# EAGLE design hydrabot (EAGLE 9.6.2)
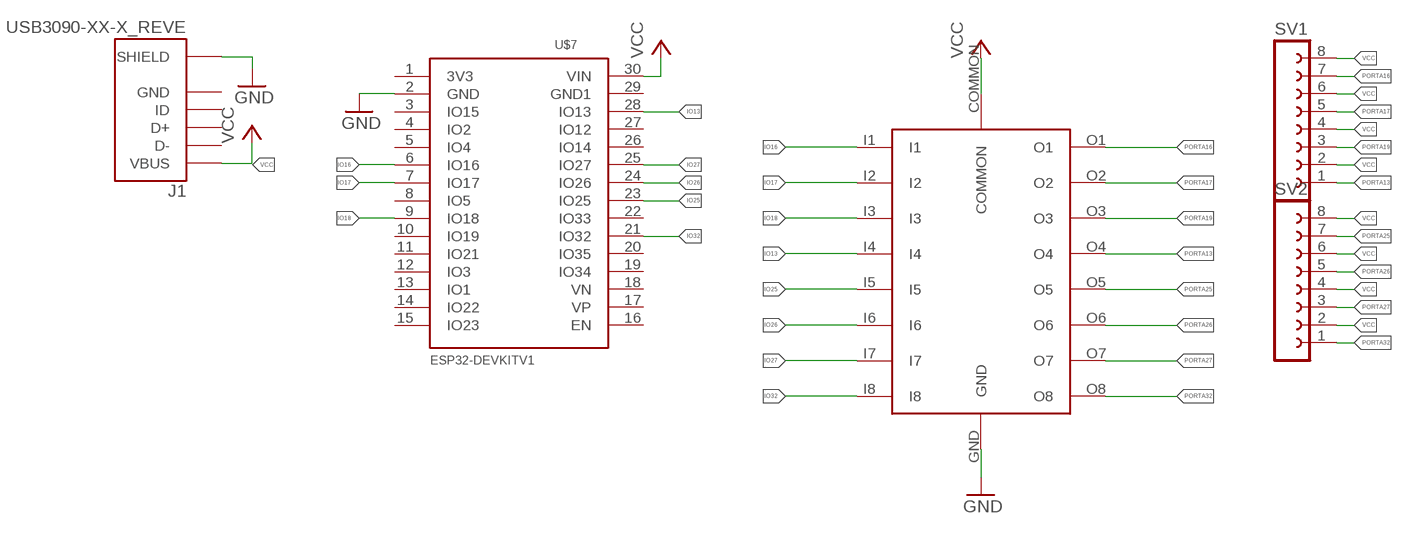
[diagram p0: schematic, sheet 1]

## Parts
J1  USB3090-XX-X_REVE  [GCT_USB3090-XX-X_REVE]
SV1  FE08-1  [FE08]
SV2  FE08-1  [FE08]
U$7  ESP32DEVKITV1  [ESP32-DEVKITV1]
ULN2803  ULN2803AFW  [ULN2803AFW]

## Nets
GND: J1.6(SHIELD) J1.7(SHIELD) J1.8(SHIELD) J1.9(SHIELD) U$7.2(GND) ULN2803.GND
IO13: U$7.28(IO13) ULN2803.I4
IO16: U$7.6(IO16) ULN2803.I1
IO17: U$7.7(IO17) ULN2803.I2
IO18: U$7.9(IO18) ULN2803.I3
IO25: U$7.23(IO25) ULN2803.I5
IO26: U$7.24(IO26) ULN2803.I6
IO27: U$7.25(IO27) ULN2803.I7
IO32: U$7.21(IO32) ULN2803.I8
PORTA13: SV1.1 ULN2803.O4
PORTA16: SV1.7 ULN2803.O1
PORTA17: SV1.5 ULN2803.O2
PORTA19: SV1.3 ULN2803.O3
PORTA25: SV2.7 ULN2803.O5
PORTA26: SV2.5 ULN2803.O6
PORTA27: SV2.3 ULN2803.O7
PORTA32: SV2.1 ULN2803.O8
VCC: J1.1(VBUS) SV1.2 SV1.4 SV1.6 SV1.8 SV2.2 SV2.4 SV2.6 SV2.8 U$7.30(VIN) ULN2803.COMMON
Unconnected: J1.2(D-) J1.3(D+) J1.4(ID) U$7.1(3V3) U$7.3(IO15) U$7.4(IO2) U$7.5(IO4) U$7.8(IO5) U$7.10(IO19) U$7.11(IO21) U$7.12(IO3) U$7.13(IO1) U$7.14(IO22) U$7.15(IO23) U$7.16(EN) U$7.17(VP) U$7.18(VN) U$7.19(IO34) U$7.20(IO35) U$7.22(IO33) U$7.26(IO14) U$7.27(IO12) U$7.29(GND1)

## Power pins joined to a net without a drawn wire
GND: J1.5(GND)

## Library data of the parts
J1 = USB3090-XX-X_REVE:USB3090-XX-X_REVE: Micro USB Receptacle, Type AB, SMT, R/A, Bottom Mount, w/out Peg, w/outer shell stakes Check prices <https://pricing.snapeda.com/parts/USB3090-30-A/Global%20Connector%20Technology/view-part?ref=eda>; AVAILABILITY: Warning; DESCRIPTION: USB - micro AB USB 2.0 Receptacle Connector 5 Position Surface Mount, Right Angle; Through Hole, 2.35mm profile, 5 Pins, Horizontal, Bottom mount; MF: Global Connector Technology; MP: USB3090-30-A; PACKAGE: None; PRICE: None; PURCHASE-URL: https://pricing.snapeda.com/search/part/USB3090-30-A/?ref=eda
SV1 SV2 = gota:FE08-1: FEMALE HEADER; OC_FARNELL: unknown; OC_NEWARK: unknown
U$7 = ESP32-DEVKITV1:ESP32DEVKITV1
ULN2803 = ULN2803AFW:ULN2803AFW: Check prices <https://pricing.snapeda.com/parts/ULN2803AFW/Toshiba/view-part?ref=eda>; AVAILABILITY: Bad; DESCRIPTION: Bipolar (BJT) Transistor Array 8 NPN Darlington 50V 500mA 1.31W Surface Mount 18-SOL; MF: Toshiba; MP: ULN2803AFW; PACKAGE: SO-18 Toshiba; PRICE: None

## Board
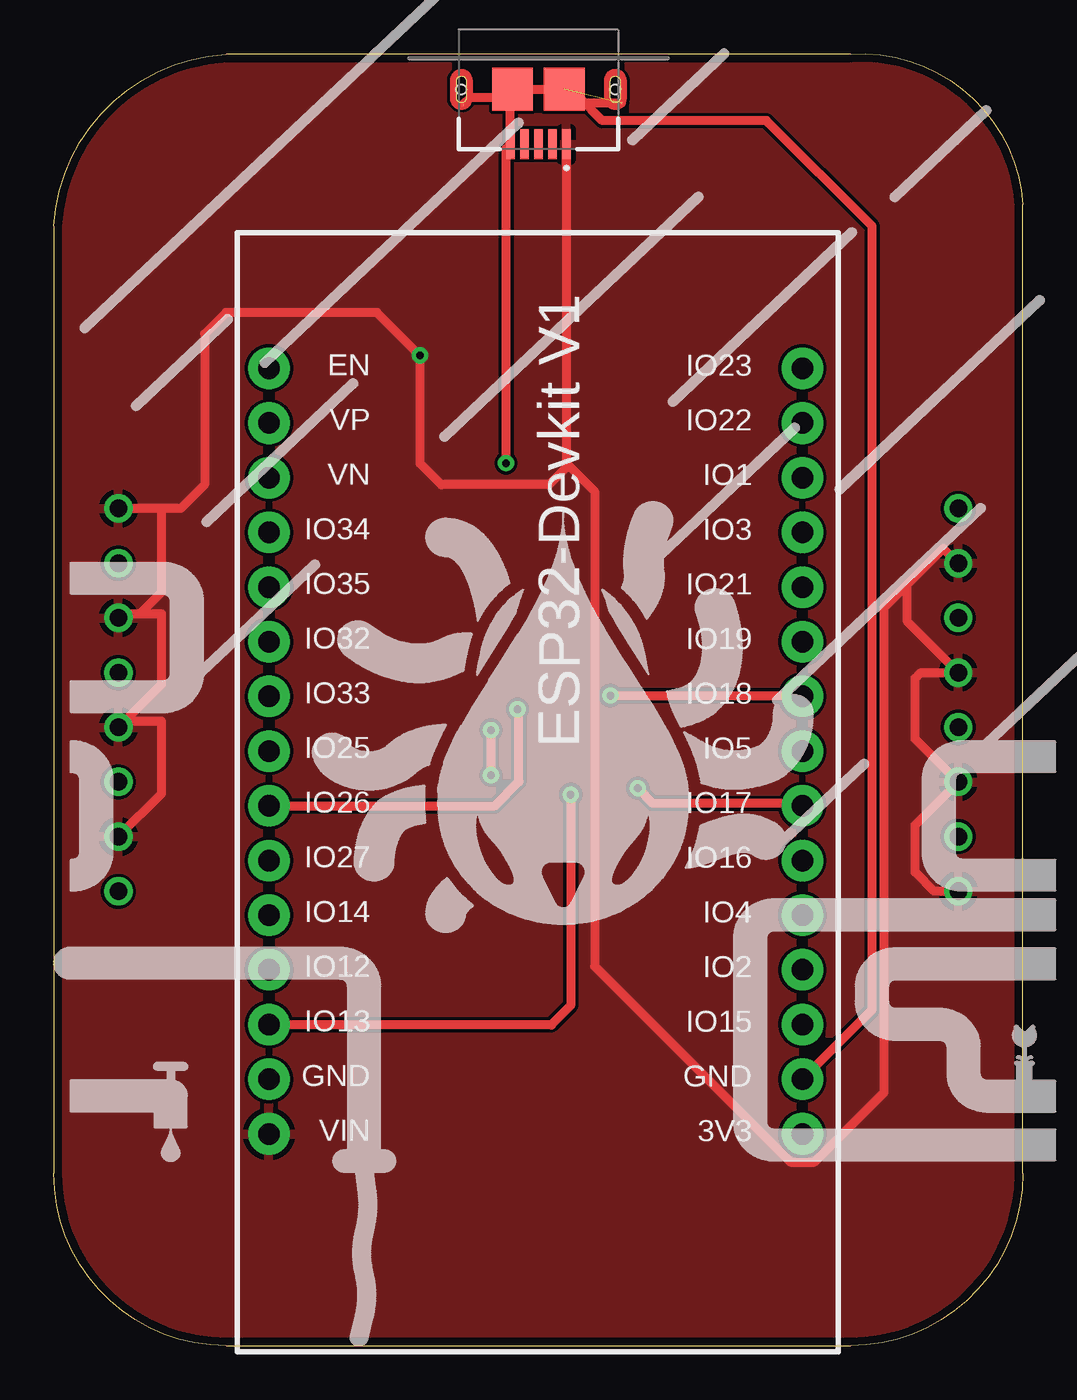
[diagram p1: board, top side]
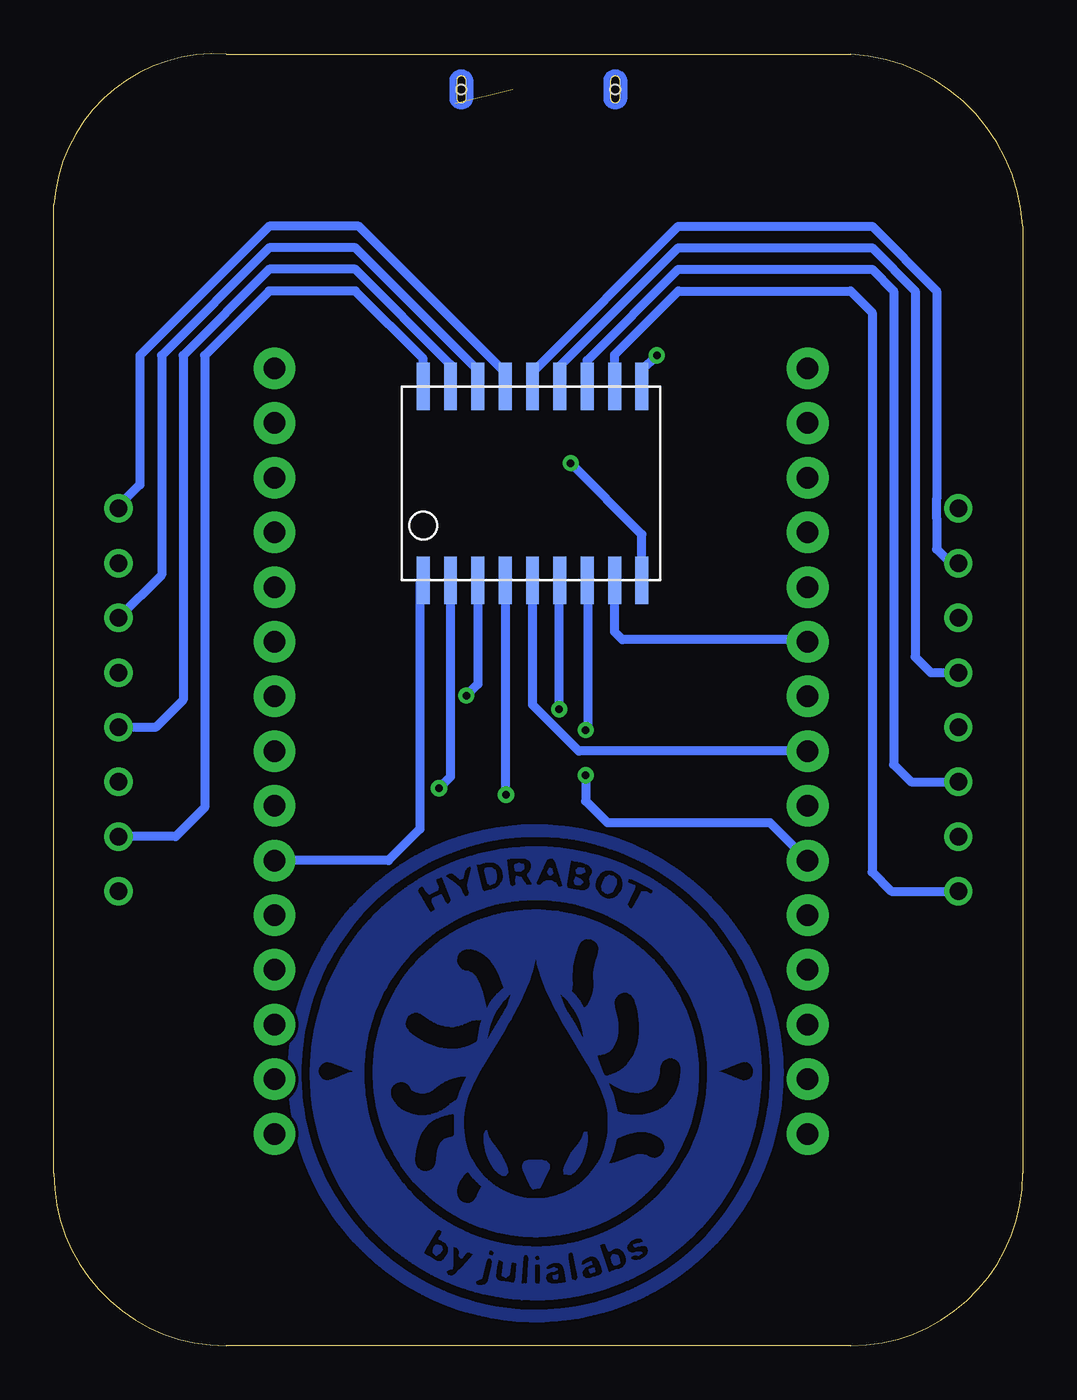
[diagram p2: board, bottom side, seen from below]

Size 45 x 60.01 mm. Coordinates in mm from the lower left corner, seen from the top.
Outline: 8,0 37,0 arc90 45,8 45,53 arc90 37,60 8,60 arc83 0,52 0,8 arc90 8,0
Copper layers (1*16): Top 0.035mm / dielectric 1.5mm / Bottom 0.035mm
Design rules "default *": minimum track width 6mil, minimum drill 0.35mm, track to track 6mil, track to pad 6mil, pad to pad 6mil, via to via 6mil, smd to smd 6mil, copper to edge 15mil, drill to drill 6mil, minimum pad ring 10mil, minimum via ring 8mil, stop-mask expansion 1mil, vias tented up to drill 0.5mm, thermal gap 10mil

### Footprints (pad centres in the part's own frame; a part is rotated, then mirrored left to right if it is on the bottom)
GCT_USB3090-XX-X_REVE = smd 0.4 x 1.4: 1 -1.3,2.55; 2 -0.65,2.55; 3 0,2.55; 4 0.65,2.55; 5 1.3,2.55 | smd 0.1 x 0.1: 6 -3.87,0.63; 7 3.51,0.72 | smd 1.9 x 2: 8 -1.2,0; 9 1.2,0 | hole 0.45: -3.575,0; 3.575,0
FE08 = drill 0.813: 1 -8.89,0; 2 -6.35,0; 3 -3.81,0; 4 -1.27,0; 5 1.27,0; 6 3.81,0; 7 6.35,0; 8 8.89,0
ESP32-DEVKITV1 = drill 1 pad 1.93: 1 -22.87,-13.54; 2 -20.33,-13.54; 3 -17.79,-13.54; 4 -15.25,-13.54; 5 -12.71,-13.54; 6 -10.17,-13.54; 7 -7.63,-13.54; 8 -5.09,-13.54; 9 -2.55,-13.54; 10 -0.01,-13.54; 11 2.53,-13.54; 12 5.07,-13.54; 13 7.61,-13.54; 14 10.15,-13.54; 15 12.69,-13.54; 16 12.69,11.23; 17 10.15,11.23; 18 7.61,11.23; 19 5.07,11.23; 20 2.53,11.23; 21 -0.01,11.23; 22 -2.55,11.23; 23 -5.09,11.23; 24 -7.63,11.23; 25 -10.17,11.23; 26 -12.71,11.23; 27 -15.25,11.23; 28 -17.79,11.23; 29 -20.33,11.23; 30 -22.87,11.23
ULN2803AFW = smd 0.6 x 2.2: COMMON 10.16,9.01; GND 10.16,0; I1 0,0; I2 1.27,0; I3 2.54,0; I4 3.81,0; I5 5.08,0; I6 6.35,0; I7 7.62,0; I8 8.89,0; O1 0,9.01; O2 1.27,9.01; O3 2.54,9.01; O4 3.81,9.01; O5 5.08,9.01; O6 6.35,9.01; O7 7.62,9.01; O8 8.89,9.01

### Placement (x,y rotation side)
J1  22.5,58.36 180 top
SV1  42,30 270 top
SV2  3,30 90 top
U$7  21.22,32.71 90 top
ULN2803  27.85,35.56 0 bottom

### Tracks (layer width: path | path; a pad name or v marks a point on that pad's centre or on a via)
GND  (via drill 0.35)  (1 unrouted)
  Top 0.406: U$7.2 38,15.62 38,52 33.08,56.92 25.48,56.92 24.39,58 24,58 24.27,57.73 J1.6 | 21.2,58 J1.5 21,55.61 v21,41 | 21.2,58 21.2,58.26 J1.9 J1.8 | J1.7 19.35,58 21.2,58
  Bottom 0.406: ULN2803.GND 17.69,37.69 v21,41
IO13  (via drill 0.35)
  Top 0.406: v24,25.6 24,15.8 23.1,14.9 10.01,14.9 U$7.28
  Bottom 0.406: ULN2803.I4 24.04,25.64 v24,25.6
IO16
  Bottom 0.406: ULN2803.I1 28,35.41 28,24 29.46,22.54 U$7.6
IO17  (via drill 0.35)
  Top 0.406: v27.12,25.9 27.82,25.2 34.64,25.2 U$7.7
  Bottom 0.406: ULN2803.I2 26.58,26.42 27.1,25.9 v27.12,25.9
IO18  (via drill 0.35)
  Top 0.406: U$7.9 34.72,30.2 v25.85,30.2
  Bottom 0.406: 34.72,30.2 U$7.9 | ULN2803.I3 25.31,30.74 v25.85,30.2
IO25
  Bottom 0.406: U$7.23 20.62,27.62 22.77,29.77 ULN2803.I5
IO26  (via drill 0.35)
  Top 0.406: v21.53,29.57 21.6,29.5 21.6,26.2 20.48,25.08 U$7.24
  Bottom 0.406: v21.53,29.57 21.53,35.53 ULN2803.I6
IO27  (via drill 0.35)
  Top 0.406: v20.3,28.6 v20.3,26.5
  Bottom 0.406: v20.3,28.6 20.2,28.7 20.2,35.53 ULN2803.I7 | v20.3,26.5 20.3,25.3 19.3,24.3 11.75,24.3 U$7.25
IO32
  Bottom 0.406: U$7.21 10.09,32.8 18.6,32.8 18.96,33.16 ULN2803.I8
LOGO
  pour Bottom (rank 3): 461 corners
  pour Bottom (rank 3): 911 corners
  pour Bottom (rank 3): 21.76,3.11 21.8,3.26 21.61,3.29 21.63,3.11
  pour Bottom (rank 3): 20.07,3.38 20.12,3.53 19.93,3.61 19.91,3.43
  pour Bottom (rank 3): 19.04,3.88 19.1,4.07 19.03,4.24 18.85,4.19 18.75,4.02 18.75,3.83 18.92,3.74
  pour Bottom (rank 3): 27.38,4.33 27.33,4.52 27.21,4.68 27.03,4.64 26.99,4.48 27.09,4.31 27.24,4.2
  pour Bottom (rank 3): 742 corners
  pour Bottom (rank 3): 22.72,7.29 22.85,7.45 23.02,7.81 23.18,8.17 23.22,8.36 23.12,8.54 22.94,8.61 22.74,8.62 22.34,8.61 22.15,8.57 22.03,8.42 22.02,8.22 22.19,7.86 22.36,7.5 22.46,7.33
  pour Bottom (rank 3): 24.16,7.92 24.33,8.01 24.46,8.16 24.58,8.32 24.69,8.49 24.78,8.67 24.85,8.85 24.91,9.04 24.95,9.24 24.98,9.44 24.99,9.64 24.99,9.84 24.92,9.98 24.87,9.79 24.8,9.6 24.7,9.43 24.57,9.27 24.45,9.12 24.33,8.96 24.22,8.79 24.12,8.61 24.04,8.44 23.96,8.25 23.93,8.05 24.06,7.91
  pour Bottom (rank 3): 21.28,7.98 21.3,8.17 21.24,8.36 21.16,8.54 21.06,8.72 20.96,8.89 20.85,9.05 20.6,9.36 20.49,9.53 20.4,9.71 20.35,9.9 20.27,9.92 20.25,9.72 20.26,9.52 20.28,9.32 20.32,9.12 20.37,8.93 20.43,8.74 20.52,8.56 20.62,8.39 20.73,8.22 20.86,8.07 21.02,7.95
  pour Bottom (rank 3): 19.38,21.03 19.51,21.17 19.53,21.37 19.46,21.55 19.38,21.73 19.21,21.84 19.02,21.78 18.9,21.63 18.92,21.43 18.99,21.25 19.1,21.08 19.28,21.01
  pour Bottom (rank 3): 24.83,21.49 24.96,22.07 24.89,22.19 24.69,22.19 24.53,22.08 24.48,21.88 24.48,21.68 24.56,21.51 24.73,21.42
  pour Bottom (rank 3): 20.81,21.59 20.74,21.75 20.56,21.67 20.43,21.54 20.55,21.43 20.75,21.43
  pour Bottom (rank 3): 20.69,21.95 20.71,22.09 20.61,22.21 20.41,22.18 20.35,22.01 20.52,21.93
  pour Bottom (rank 3): 22.05,22 21.97,22.18 21.9,22.14 21.86,21.95 21.95,21.86
  pour Bottom (rank 3): 23.57,22.34 23.4,22.4 23.22,22.36 23.17,22.18 23.33,22.07 23.53,22.05 23.57,22.21
PORTA13
  Bottom 0.406: ULN2803.O4 24.04,45.2 30.84,52 35,52 41,46 41,40 42,39 SV1.1
PORTA16
  Bottom 0.406: ULN2803.O1 27.85,45.85 31,49 35,49 38,46 38,25 39.35,23.65 SV1.7
PORTA17
  Bottom 0.406: ULN2803.O2 26.58,45.58 31,50 35,50 39,46 39,30 40.27,28.73 SV1.5
PORTA19
  Bottom 0.406: ULN2803.O3 25.31,45.31 31,51 35,51 40,46 40,35.81 SV1.3
PORTA25
  Bottom 0.406: ULN2803.O5 22.77,45.23 16,52 7,52 4,49 4,39.33 4.02,39.31 4.02,38.47 4,38.45 4,37 3.35,36.35 SV2.7
PORTA26
  Bottom 0.406: ULN2803.O6 21.5,45.5 16,51 7,51 5,49 5,32 4.27,31.27 SV2.5
PORTA27
  Bottom 0.406: ULN2803.O7 20.23,45.77 16,50 7,50 6,49 6,27 5.19,26.19 SV2.3
PORTA32
  Bottom 0.406: ULN2803.O8 18.96,46.04 16,49 8,49 7,48 7,22 6.11,21.11 SV2.1
VCC  (via drill 0.35)
  Top 0.406: 5,38.89 5.89,38.89 7,40 7,47 8,48 15,48 v17,46 17,41 18,40 23,40 23.8,40.8 23.8,41 | 5,38.89 SV2.8 | J1.1 23.8,41 | SV1.2 41.31,37.04 39.64,35.36 | 39.64,35.36 38.56,34.28 38.56,11.77 35.31,8.52 34.21,8.52 25.11,17.62 25.11,39.69 23.8,41 | SV2.2 5,25.65 5,29 3.27,29 SV2.4 5,30.73 5,34 4,34 | 4,34 3.19,34 SV2.6 | 4,34 5,35 5,38.89 | SV1.8 40.89,21.11 40,22 40,24.19 SV1.6 40,28.19 40,31 40.27,31.27 SV1.4 39.64,33.63 39.64,35.36
  Bottom 0.406: ULN2803.COMMON 17.69,45.31 v17,46
  pour Top (rank 3): 0,0 45,0 45,60 0,60

### Text on the board
tRestrict: vcc